# EAGLE design rj12 breakout (EAGLE 7.7.0)
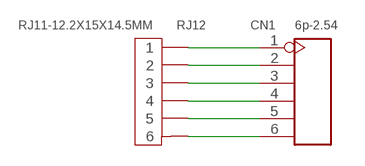
[diagram p0: schematic, sheet 1]

## Parts
CN1  6p-2.54  DIP-BLACK-FEMALE-HEADER-VERT(6P-2.54)  [H6-2.54]
RJ12  RJ11-12.2X15X14.5MM  DIP-RJ11-CONNECTOR  [RJ11--12.2X15X14.5MM]

## Nets
N$1: CN1.1 RJ12.1
N$2: CN1.2 RJ12.2
N$3: CN1.3 RJ12.3
N$4: CN1.4 RJ12.4
N$5: CN1.5 RJ12.5
N$6: CN1.6 RJ12.6

## Library data of the parts
CN1 = Seeed-OPL-Connector:DIP-BLACK-FEMALE-HEADER-VERT(6P-2.54): 320030060; MPN: F185-1106A1BSYC1
RJ12 = Seeed-OPL-Connector:DIP-RJ11-CONNECTOR: 320140002

## Board
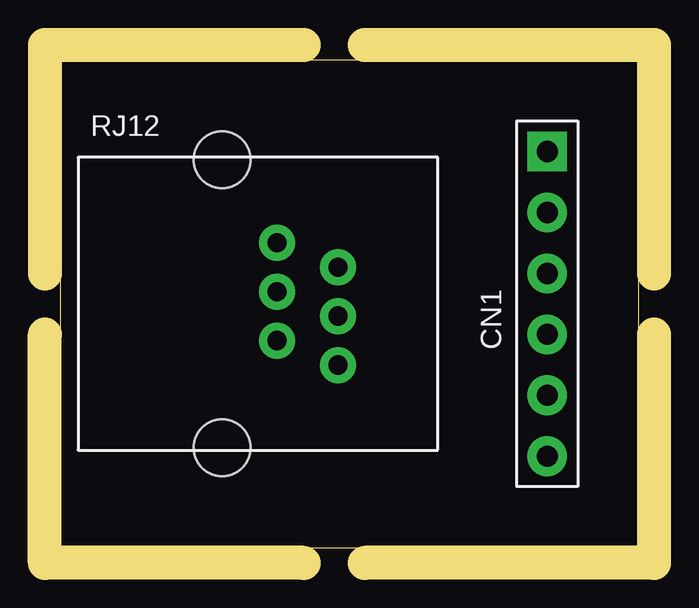
[diagram p1: board, top side]
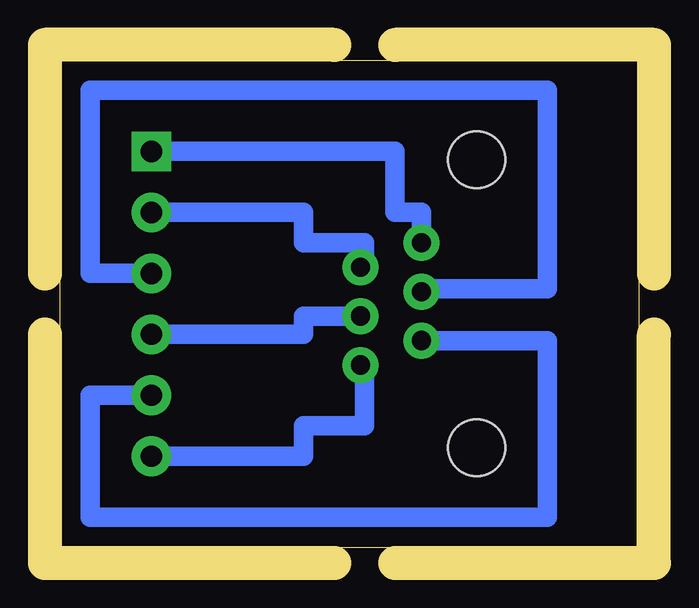
[diagram p2: board, bottom side, seen from below]

Size 24.13 x 20.32 mm. Coordinates in mm from the lower left corner, seen from the top.
Outline: 0,0 24.13,0 24.13,20.32 0,20.32 0,0
Copper layers (1*16): Top 0.035mm / dielectric 1.5mm / Bottom 0.035mm
Design rules "default": minimum track width 10mil, minimum drill 24mil, track to track 8mil, track to pad 8mil, pad to pad 8mil, via to via 8mil, smd to smd 8mil, copper to edge 40mil, drill to drill 8mil, minimum pad ring 10mil, minimum via ring 8mil, stop-mask expansion 4mil, vias tented up to drill 0mil, thermal gap 10mil
Milling: 8 lines

### Footprints (pad centres in the part's own frame; a part is rotated, then mirrored left to right if it is on the bottom)
H6-2.54 = drill 0.889 pad 1.651 square: 1 0,6.35 | drill 0.889 pad 1.651: 2 0,3.81; 3 0,1.27; 4 0,-1.27; 5 0,-3.81; 6 0,-6.35
RJ11--12.2X15X14.5MM = drill 0.8 pad 1.5: 1 0.8,2.55; 2 3.34,1.53; 3 0.8,0.51; 4 3.34,-0.51; 5 0.8,-1.53; 6 3.34,-2.55 | hole 2.36: -1.5,6; -1.5,-6

### Placement (x,y rotation side)
CN1  20.32,10.16 0 top
RJ12  8.26,10.16 0 top

### Tracks (layer width: path | path; a pad name or v marks a point on that pad's centre or on a via)
N$1
  Bottom 0.813: CN1.1 10.16,16.51 10.16,13.97 9.05,13.97 RJ12.1
N$2
  Bottom 0.813: RJ12.2 11.43,11.69 11.43,12.7 13.97,12.7 13.97,13.97 CN1.2
N$3
  Bottom 0.813: CN1.3 22.86,11.43 22.86,19.05 3.81,19.05 3.81,10.79 9.05,10.79 RJ12.3
N$4
  Bottom 0.813: RJ12.4 13.97,9.65 13.97,8.89 CN1.4
N$5
  Bottom 0.813: RJ12.5 3.81,8.63 3.81,1.27 22.86,1.27 22.86,6.35 CN1.5
N$6
  Bottom 0.813: RJ12.6 11.43,7.61 11.43,5.08 13.97,5.08 13.97,3.81 CN1.6